# Altium schematic sheet DSPcontrol.SchDoc: DSP Control
size A4; Date: 08.04.2017; Author: Jan Petrik; CompanyName: FreeDSP; DrawnBy: Jan Petrik; Organization: FreeDSP; DocumentNumber: 10; SheetNumber: 10; SheetTotal: 16; Version1: N/A; Version2: N/A; Version3: N/A; Change1description: N/A; Change2description: N/A; Change3description: N/A; Change1DrawnBy: N/A; Change2DrawnBy: N/A; Change3DrawnBy: N/A; Change1CheckedBy: N/A; Change2CheckedBy: N/A; Change3CheckedBy: N/A; PreviusVersion_Chng1: N/A; PreviusVersion_Chng2: N/A; PreviusVersion_Chng3: N/A; Variant1description: Standard assembly; Variant2description: N/A; Variant3description: N/A; Variant4description: N/A; email: jan_petrik@centrum.cz; license: CC BY-NC 4.0
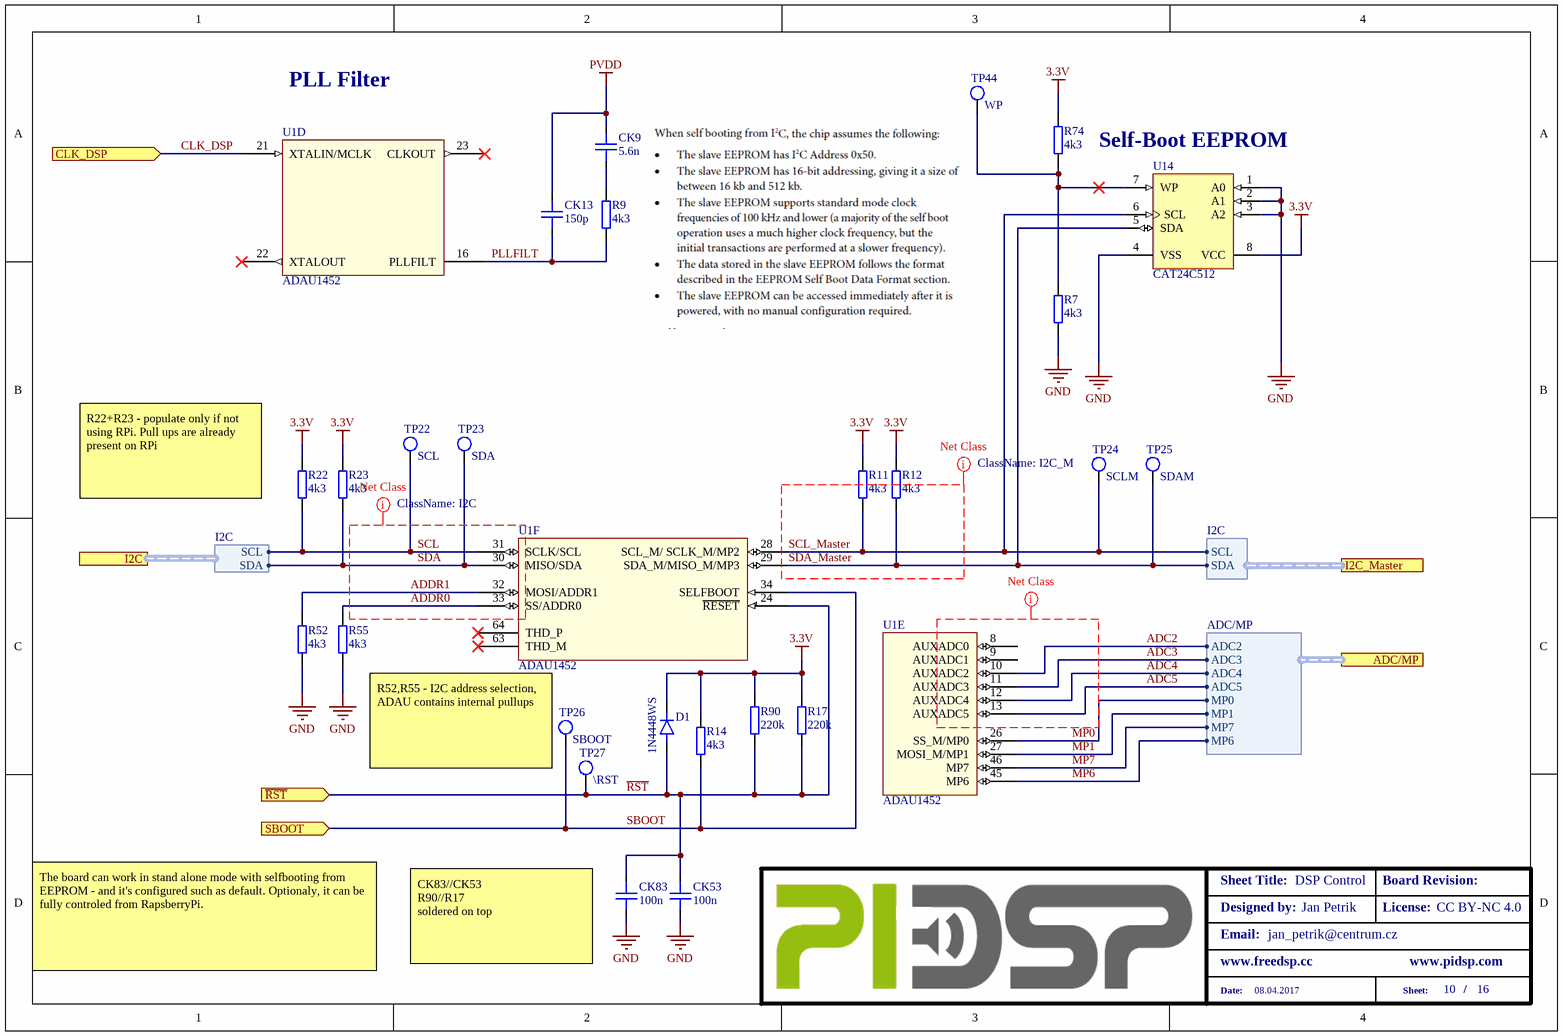
[diagram p0: DSPcontrol.SchDoc]

## Parts
CK9  5.6n  [CAPC1608X09N(SMC0603)]
CK13  150p  [CAPC1608X09N(SMC0603)]
CK53  100n  [CAPC1608X09N(SMC0603)]
CK83  100n  [CAPC1608X09N(SMC0603)]
D1  1N4448WS  [SOD-323]
R7  4k3  [RESC1608X06N(SMR0603)]
R9  4k3  [RESC1608X06N(SMR0603)]
R11  4k3  [RESC1608X06N(SMR0603)]
R12  4k3  [RESC1608X06N(SMR0603)]
R14  4k3  [RESC1608X06N(SMR0603)]
R17  220k  [RESC1608X06N(SMR0603)]
R22  4k3  [RESC1608X06N(SMR0603)]
R23  4k3  [RESC1608X06N(SMR0603)]
R52  4k3  [RESC1608X06N(SMR0603)]
R55  4k3  [RESC1608X06N(SMR0603)]
R74  4k3  [RESC1608X06N(SMR0603)]
R90  220k  [RESC1608X06N(SMR0603)]
TP22  SCL  [TP_0.8/0.4_ROUND]  (no BOM)
TP23  SDA  [TP_0.8/0.4_ROUND]  (no BOM)
TP24  SCLM  [TP_0.8/0.4_ROUND]  (no BOM)
TP25  SDAM  [TP_0.8/0.4_ROUND]  (no BOM)
TP26  SBOOT  [TP_0.8/0.4_ROUND]  (no BOM)
TP27  \RST  [TP_0.8/0.4_ROUND]  (no BOM)
TP44  WP  [TP_0.8/0.4_ROUND]  (no BOM)
U1  ADAU1452  [CP_72_6-handsoldering]  (parts D,E,F of 6)
U14  CAT24C512  [SOIC127P600X175-8N(SOIC_8)]

## Ports
ADC/MP (harness ADC/MP), CLK_DSP (in), I2C (harness I2C), I2C_Master (harness I2C), SBOOT (in), ~{RST} (in)

## Harnesses
I2C: SDA, SCL
ADC/MP: ADC2, ADC3, ADC4, ADC5, MP1, MP0, MP7, MP6
I2C: SCL, SDA

## Nets
3.3V: D1.1(C) R11.2 R12.2 R14.2 R17.2 R22.2 R23.2 R74.2 R90.2 U14.8(VCC)
GND: CK53.2 CK83.2 R7.1 R52.1 R55.1 U14.1(A0) U14.2(A1) U14.3(A2) U14.4(VSS)
PVDD: CK9.1 CK13.1
~{RST}: CK53.1 CK83.1 D1.2(A) R17.1 R90.1 TP27.1 U1.24(~{RESET}) ; port ~{RST}
ADC2: U1.10(AUXADC2) ; port ADC/MP.ADC2
ADC3: U1.11(AUXADC3) ; port ADC/MP.ADC3
ADC4: U1.12(AUXADC4) ; port ADC/MP.ADC4
ADC5: U1.13(AUXADC5) ; port ADC/MP.ADC5
ADDR0: R55.2 U1.33(SS/ADDR0)
ADDR1: R52.2 U1.32(MOSI/ADDR1)
CLK_DSP: U1.21(XTALIN/MCLK) ; port CLK_DSP
MP0: U1.26(SS_M/MP0) ; port ADC/MP.MP0
MP1: U1.27(MOSI_M/MP1) ; port ADC/MP.MP1
MP6: U1.45(MP6) ; port ADC/MP.MP6
MP7: U1.46(MP7) ; port ADC/MP.MP7
PLLFILT: CK13.2 R9.1 U1.16(PLLFILT)
SBOOT: R14.1 TP26.1 U1.34(SELFBOOT) ; port SBOOT
SCL: R22.1 TP22.1 U1.31(SCLK/SCL) ; port I2C.SCL
SCL_Master: R11.1 TP24.1 U1.28(SCL_M/_SCLK_M/MP2) U14.6(SCL) ; port I2C_Master.SCL
SDA: R23.1 TP23.1 U1.30(MISO/SDA) ; port I2C.SDA
SDA_Master: R12.1 TP25.1 U1.29(SDA_M/MISO_M/MP3) U14.5(SDA) ; port I2C_Master.SDA
NetCK9_2: CK9.2 R9.2
NetR7_2: R7.2 R74.1 TP44.1 U14.7(WP)

Not connected (* = marked no-connect by the designer): U1 8(AUXADC0) 9(AUXADC1) 22(XTALOUT)* 23(CLKOUT)* 63(THD_M)* 64(THD_P)*

## Layout directives
net class I2C: ADDR0, ADDR1, SCL, SDA
net class ADC: (no net found under the mark)
net class I2C_M: SCL_Master, SDA_Master

## Notes on the sheet
- PLL Filter
- Self-Boot EEPROM
- (near R22) R22+R23 - populate only if not using RPi. Pull ups are already present on RPi
- (near TP26) R52,R55 - I2C address selection,
  ADAU contains internal pullups
- The board can work in stand alone mode with selfbooting from EEPROM - and it's configured such as default. Optionaly, it can be fully controled from RapsberryPi.
- (near CK83) CK83//CK53
  R90//R17
  soldered on top
- Designed by:
- Sheet Title:
- Board Revision:
- License:
- Email:
- www.freedsp.cc
- www.pidsp.com
- Date:
- Sheet:
- /

## Library data of the parts
CK9 = 5.6n-50V-0603-X7R: MLCC; Mfg. Part Number: 81-GRM1885C1H562JA1D; Signal Integrity: Cap; Tolerance: 10%; Voltage: 50V; Mfgr.: Murata; Value: 5.6n; Package: SMC0603; Simulation: Cap; Author: JP/27.03.2014; Supplier 1: Mouser
CK13 = 150p-50V-0603-NP0: MLCC; Mfg. Part Number: 80-C0603C151J5G; Signal Integrity: Cap; Tolerance: 10%; Voltage: 50V; Value: 150p; Package: SMC0603; Simulation: Cap; Author: JP/27.03.2014; Supplier 1: Mouser
CK53 CK83 = 100n-50V-0603-X7R: MLCC; Signal Integrity: Cap; Voltage: 50V; Tolerance: 10%; Value: 100n; Package: SMC2523; Simulation: Cap; Author: JP/27.03.2014; Supplier 1: Mouser; Supplier Part Number 1: 81-GRM39X104K50D
D1 = 1N4448WS: Small signal diode; Current: 0.150A; Voltage: 75V; SMD: 1; Type: Diode; Package: SOD-323; Supplier 1: Mouser; Supplier Part Number 1: 512-1N4448WS
R7 R9 R11 R12 R14 R22 R23 R52 R55 R74 = 4K3-100mW-0603-ThickFilm: Chip Resistor; Tolerance & Rating: 1%/0.1W; Signal Integrity: Res; Packare: SMR0603; Value: 4k3; Simulation: Res; Author: JP/10.06.2014; SMD: 1; Supplier 1: Mouser; Supplier Part Number 1: 603-RC0603FR-074K3L; Type: Resistor
R17 R90 = 220k-100mW-0603-ThickFilm: Chip Resistor; Tolerance & Rating: 1%/0.1W; Signal Integrity: Res; Packare: SMR0603; Value: 220k; Simulation: Res; Author: JP/10.06.2014; SMD: 1; Supplier 1: Mouser; Supplier Part Number 1: 603-RC0603FR-07220KL; Type: Resistor
TP22-TP27 TP44 = TEST_POINT_VIA: Testpoint - VIA; Value: 0.65/1.55; SMD: -; ClassName: TP
U14 = CAT24C512: 512 Kb I2C CMOS Serial  EEPROM; Supplier 1: Mouser; Supplier Part Number 1: 863-CAT24C512WI-GT3
U1 = ADAU1452: SMD: 1; Supplier 1: Mouser; Supplier Part Number 1: 584-ADAU1452WBCPZ